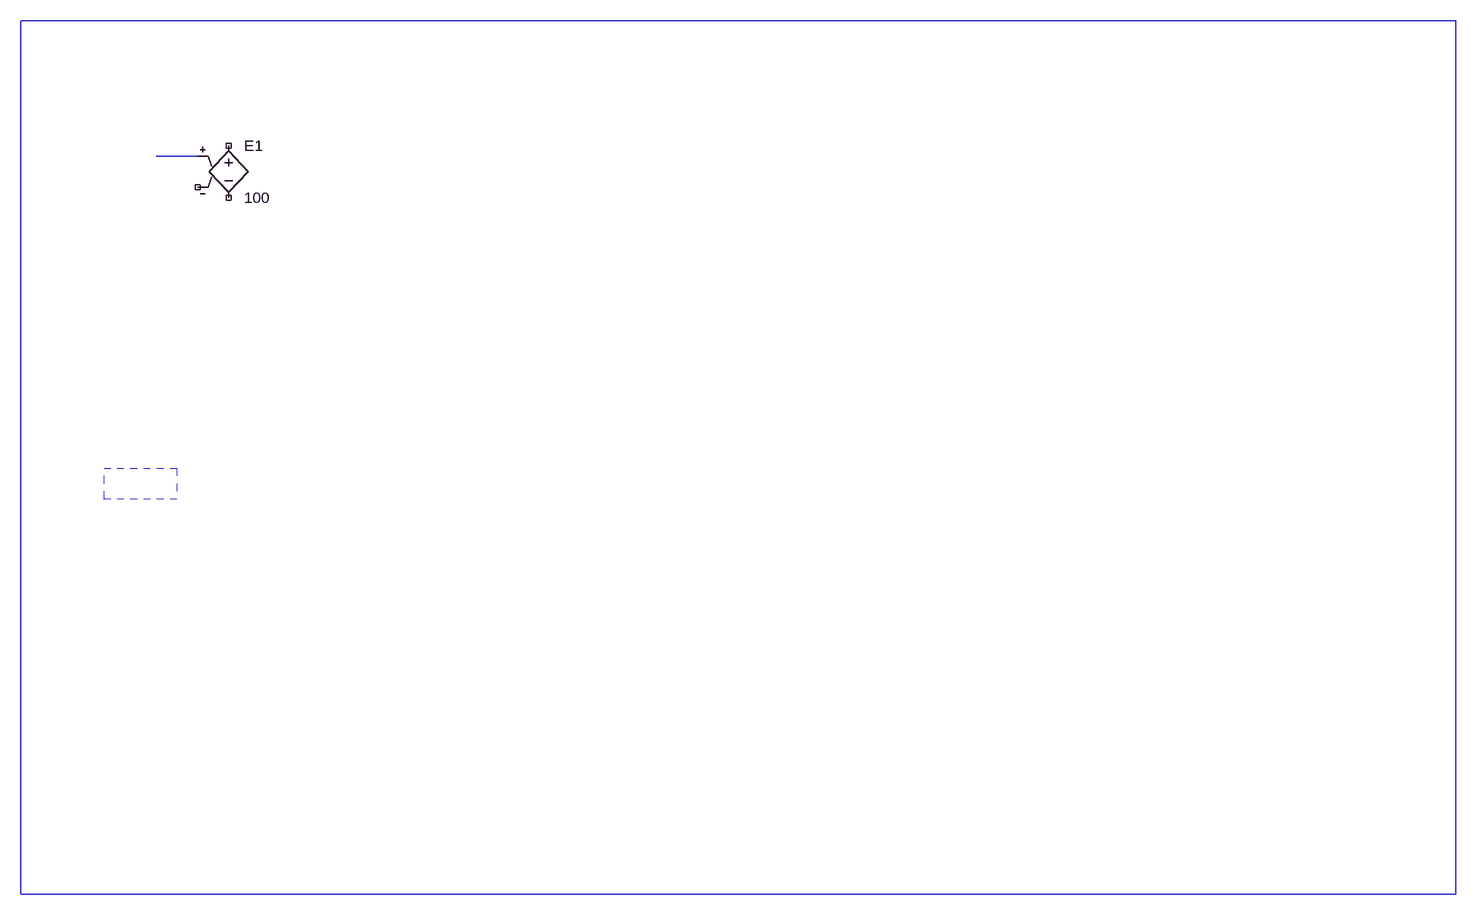
[diagram p0: schematic 07- All dashed bug.asc]
07- All dashed bug.asc, the LTspice schematic file:
Version 4.1
SHEET 1 2036 3832
WIRE 96 1088 32 1088
SYMBOL e 144 1056 R0
SYMATTR InstName E1
SYMATTR Value 100
RECTANGLE Normal 2032 2224 -176 880
RECTANGLE Normal 64 1616 -48 1568 2

The netlist it stands for:
* 07- All dashed bug.asc
E1 NC_01 NC_02 N001 NC_03 100
.backanno
.end